# Altium schematic sheet HF-Lipomon-pcb1.SchDoc
size A4
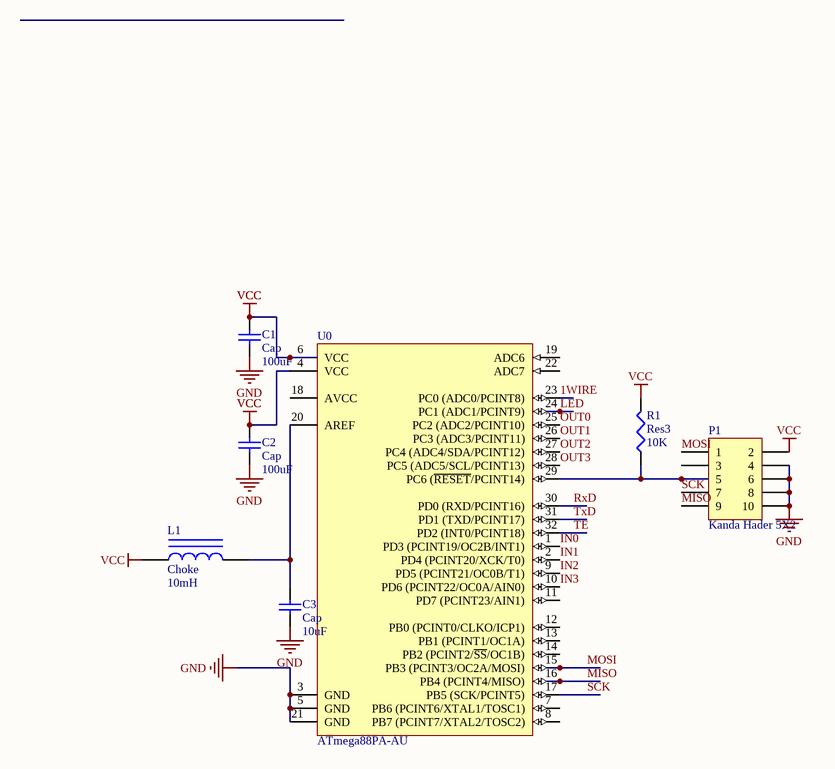
[diagram p0: HF-Lipomon-pcb1.SchDoc]

## Parts
C1  Cap  value 100uF  [RAD-0.3]
C2  Cap  value 100uF  [RAD-0.3]
C3  Cap  value 10uF  [RAD-0.3]
L1  Choke  value 10mH  [AXIAL-0.9]
P1  Kanda Hader 5X2  [HDR2X5]
R1  Res3  value 10K  [6-0805_N]
U0  ATmega88PA-AU  [32A_N]

## Nets
GND: C1.1 C2.1 C3.1 P1.4 P1.6 P1.8 P1.10 U0.3(GND) U0.5(GND) U0.21(GND)
VCC: C1.2 C2.2 L1.1 P1.2 R1.2 U0.4(VCC) U0.6(VCC)
1WIRE: U0.23(PC0_(ADC0/PCINT8))
IN0: U0.1(PD3_(PCINT19/OC2B/INT1))
IN1: U0.2(PD4_(PCINT20/XCK/T0))
IN2: U0.9(PD5_(PCINT21/OC0B/T1))
IN3: U0.10(PD6_(PCINT22/OC0A/AIN0))
LED: U0.24(PC1_(ADC1/PCINT9))
MISO: P1.9 U0.16(PB4_(PCINT4/MISO))
MOSI: P1.1 U0.15(PB3_(PCINT3/OC2A/MOSI))
OUT0: U0.25(PC2_(ADC2/PCINT10))
OUT1: U0.26(PC3_(ADC3/PCINT11))
OUT2: U0.27(PC4_(ADC4/SDA/PCINT12))
OUT3: U0.28(PC5_(ADC5/SCL/PCINT13))
RxD: U0.30(PD0_(RXD/PCINT16))
SCK: P1.7 U0.17(PB5_(SCK/PCINT5))
TE: U0.32(PD2_(INT0/PCINT18))
TxD: U0.31(PD1_(TXD/PCINT17))
NetC3_2: C3.2 L1.2 U0.20(AREF)
NetP1_5: P1.5 R1.1 U0.29(PC6_(~{RESET}/PCINT14))

Not connected (* = marked no-connect by the designer): P1 3; U0 7(PB6_(PCINT6/XTAL1/TOSC1)) 8(PB7_(PCINT7/XTAL2/TOSC2)) 11(PD7_(PCINT23/AIN1)) 12(PB0_(PCINT0/CLKO/ICP1)) 13(PB1_(PCINT1/OC1A)) 14(PB2_(PCINT2/~{SS}/OC1B)) 18(AVCC) 19(ADC6) 22(ADC7)

## Library data of the parts
C1-C3 = Cap: Capacitor; Published: 8-Jun-2000; LatestRevisionDate: 17-Jul-2002; LatestRevisionNote: Re-released for DXP Platform.; PackageReference: RAD-0.3; Publisher: Altium Limited; PackageDescription: Radial Cap, Thru-Hole; 2 Leads; 0.3 in Pin Spacing
L1 = Inductor Iron: Magnetic-Core Inductor; Published: 24-Mar-1999; LatestRevisionDate: 17-Jul-2002; LatestRevisionNote: Re-released for DXP Platform.; PackageReference: AXIAL-0.9; Publisher: Altium Limited; PackageDescription: Axial Device, Thru-Hole; 2 Leads; 0.9 in Pin Spacing
P1 = Header 5X2: Header, 5-Pin, Dual row; LatestRevisionDate: 17-Jul-2010; LatestRevisionNote: Re-released for DXP Platform.; Publisher: Altium Limited
R1 = Res3: Resistor; Published: 8-Jun-2000; LatestRevisionDate: 29-May-2009; LatestRevisionNote: IPC-7351 Footprint Added.; PackageReference: J1-0603; Publisher: Altium Limited; PackageDescription: Chip Resistor
U0 = ATmega88PA-AU: 8-bit AVR Microcontroller, 8KB Flash, 512 Bytes EEPROM, 1KB SRAM, 32-pin TQFP, Industrial Grade (-40°C to 85°C); Published: 1-Apr-2010; DatasheetVersion: revA, Jan-2010; PackageVersion: revB, Oct-2001; PackageReference: 32A; Publisher: Altium Limited; PackageDescription: 32-Lead, 7x7x1.0 mm Body, 0.8mm Lead Pitch, Thin Profile Plastic Quad Flat Package (TQFP); Supplier 1: Digi-Key; Supplier Part Number 1: ATMEGA88PA-AU-ND; Supplier 2: Farnell; Supplier Part Number 2: 1715490; Supplier 3: Mouser; Supplier Part Number 3: 556-ATMEGA88PA-AU; Code_JEDEC: MS-026-ABA; ComponentLink1Description: Manufacturer Link; ComponentLink1URL: http://www.atmel.com/products/avr/default.asp?; ComponentLink2Description: ATmega48A/48PA/88A/88PA/168A/168PA/328/328P Datasheet; ComponentLink2URL: http://www.atmel.com/dyn/resources/prod_documents/8271.pdf; ComponentLink3Description: ATmega48A/48PA/88A/88PA/168A/168PA/328/328P Summary; ComponentLink3URL: http://www.atmel.com/dyn/resources/prod_documents/8271S.pdf; ComponentLink4Description: Atmel.com Home; ComponentLink4URL: http://www.atmel.com